# Altium schematic sheet Resistors.SchDoc
size A4; SheetNumber: 2; SheetTotal: 2
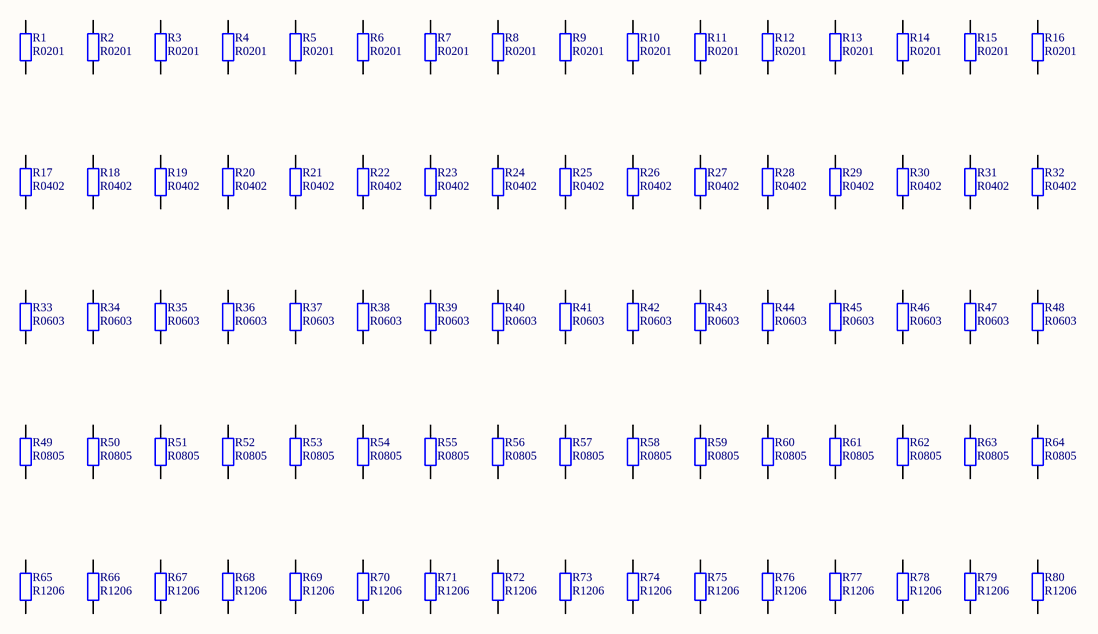
[diagram p0: Resistors.SchDoc]

## Parts
R1  R0201  [R0201-paste]
R2  R0201  [R0201-paste]
R3  R0201  [R0201-paste]
R4  R0201  [R0201-paste]
R5  R0201  [R0201-paste]
R6  R0201  [R0201-paste]
R7  R0201  [R0201-paste]
R8  R0201  [R0201-paste]
R9  R0201  [R0201-paste]
R10  R0201  [R0201-paste]
R11  R0201  [R0201-paste]
R12  R0201  [R0201-paste]
R13  R0201  [R0201-paste]
R14  R0201  [R0201-paste]
R15  R0201  [R0201-paste]
R16  R0201  [R0201-paste]
R17  R0402  [R0402-Paste]
R18  R0402  [R0402-Paste]
R19  R0402  [R0402-Paste]
R20  R0402  [R0402-Paste]
R21  R0402  [R0402-Paste]
R22  R0402  [R0402-Paste]
R23  R0402  [R0402-Paste]
R24  R0402  [R0402-Paste]
R25  R0402  [R0402-Paste]
R26  R0402  [R0402-Paste]
R27  R0402  [R0402-Paste]
R28  R0402  [R0402-Paste]
R29  R0402  [R0402-Paste]
R30  R0402  [R0402-Paste]
R31  R0402  [R0402-Paste]
R32  R0402  [R0402-Paste]
R33  R0603  [R0603_PASTE]
R34  R0603  [R0603_PASTE]
R35  R0603  [R0603_PASTE]
R36  R0603  [R0603_PASTE]
R37  R0603  [R0603_PASTE]
R38  R0603  [R0603_PASTE]
R39  R0603  [R0603_PASTE]
R40  R0603  [R0603_PASTE]
R41  R0603  [R0603_PASTE]
R42  R0603  [R0603_PASTE]
R43  R0603  [R0603_PASTE]
R44  R0603  [R0603_PASTE]
R45  R0603  [R0603_PASTE]
R46  R0603  [R0603_PASTE]
R47  R0603  [R0603_PASTE]
R48  R0603  [R0603_PASTE]
R49  R0805  [R0805_PASTE]
R50  R0805  [R0805_PASTE]
R51  R0805  [R0805_PASTE]
R52  R0805  [R0805_PASTE]
R53  R0805  [R0805_PASTE]
R54  R0805  [R0805_PASTE]
R55  R0805  [R0805_PASTE]
R56  R0805  [R0805_PASTE]
R57  R0805  [R0805_PASTE]
R58  R0805  [R0805_PASTE]
R59  R0805  [R0805_PASTE]
R60  R0805  [R0805_PASTE]
R61  R0805  [R0805_PASTE]
R62  R0805  [R0805_PASTE]
R63  R0805  [R0805_PASTE]
R64  R0805  [R0805_PASTE]
R65  R1206  [R1206_PASTE]
R66  R1206  [R1206_PASTE]
R67  R1206  [R1206_PASTE]
R68  R1206  [R1206_PASTE]
R69  R1206  [R1206_PASTE]
R70  R1206  [R1206_PASTE]
R71  R1206  [R1206_PASTE]
R72  R1206  [R1206_PASTE]
R73  R1206  [R1206_PASTE]
R74  R1206  [R1206_PASTE]
R75  R1206  [R1206_PASTE]
R76  R1206  [R1206_PASTE]
R77  R1206  [R1206_PASTE]
R78  R1206  [R1206_PASTE]
R79  R1206  [R1206_PASTE]
R80  R1206  [R1206_PASTE]

## Nets

Not connected (* = marked no-connect by the designer): R1 1 2; R2 1 2; R3 1 2; R4 1 2; R5 1 2; R6 1 2; R7 1 2; R8 1 2; R9 1 2; R10 1 2; R11 1 2; R12 1 2; R13 1 2; R14 1 2; R15 1 2; R16 1 2; R17 1 2; R18 1 2; R19 1 2; R20 1 2; R21 1 2; R22 1 2; R23 1 2; R24 1 2; R25 1 2; R26 1 2; R27 1 2; R28 1 2; R29 1 2; R30 1 2; R31 1 2; R32 1 2; R33 1 2; R34 1 2; R35 1 2; R36 1 2; R37 1 2; R38 1 2; R39 1 2; R40 1 2; R41 1 2; R42 1 2; R43 1 2; R44 1 2; R45 1 2; R46 1 2; R47 1 2; R48 1 2; R49 1 2; R50 1 2; R51 1 2; R52 1 2; R53 1 2; R54 1 2; R55 1 2; R56 1 2; R57 1 2; R58 1 2; R59 1 2; R60 1 2; R61 1 2; R62 1 2; R63 1 2; R64 1 2; R65 1 2; R66 1 2; R67 1 2; R68 1 2; R69 1 2; R70 1 2; R71 1 2; R72 1 2; R73 1 2; R74 1 2; R75 1 2; R76 1 2; R77 1 2; R78 1 2; R79 1 2; R80 1 2

## Library data of the parts
R1-R16 = R-0201: RES SMD 0201; Value: R0201; Manufacturer: -; Manufacturer PN: -; Supplier: digikey.ca
R17-R32 = R-0402: RES SMD 0402; Value: R0402; Manufacturer: -; Manufacturer PN: -; Supplier: digikey.ca
R33-R48 = R-0603: RES SMD 0603; Value: R0603; Manufacturer: -; Manufacturer PN: -; Supplier: digikey.ca
R49-R64 = R-0805: RES SMD 0805; Value: R0805; Manufacturer: -; Manufacturer PN: -; Supplier: digikey.ca
R65-R80 = R-1206: RES SMD 1206; Value: R1206; Manufacturer: -; Manufacturer PN: -; Supplier: digikey.ca